# EAGLE design coffee-bot (EAGLE 7.6.0)
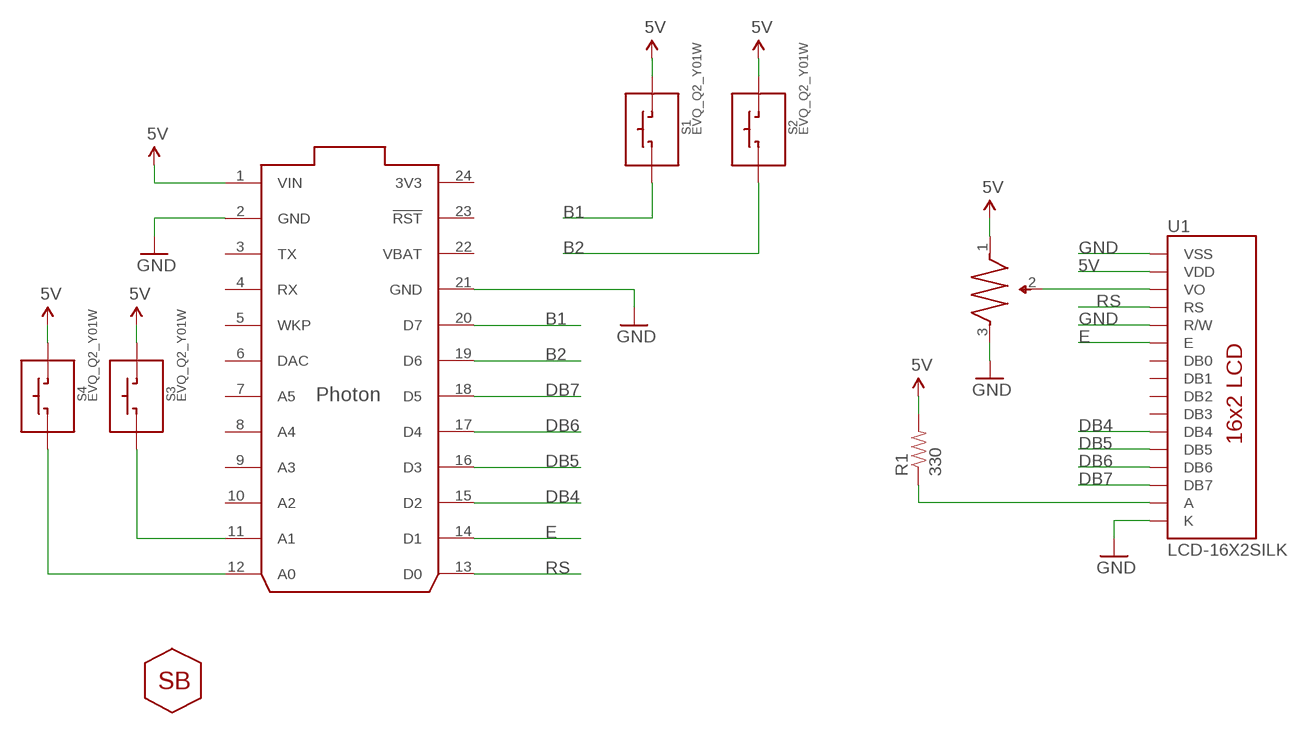
[diagram p0: schematic, sheet 1]

## Parts
R1  330  RESISTOR1206  [1206]
S1  EVQ_Q2_Y01W  [EVQQ2]
S2  EVQ_Q2_Y01W  [EVQQ2]
S3  EVQ_Q2_Y01W  [EVQQ2]
S4  EVQ_Q2_Y01W  [EVQQ2]
U1  LCD-16X2SILK  [LCD-16X2]
U2  PHOTON_SMD  [PHOTON_SMD]
U$2  TC-33X2  [TC-33X2]
U$3  SBLOGO250MIL  [SBLOGO]

## Nets
5V: R1.2 S1.B1(B) S1.B2(B) S2.B1(B) S2.B2(B) S3.B1(B) S3.B2(B) S4.B1(B) S4.B2(B) U1.2(VDD) U2.1(VIN) U$2.1
B1: S1.A1(A) S1.A2(A) U2.20(D7)
B2: S2.A1(A) S2.A2(A) U2.19(D6)
DB4: U1.11(DB4) U2.15(D2)
DB5: U1.12(DB5) U2.16(D3)
DB6: U1.13(DB6) U2.17(D4)
DB7: U1.14(DB7) U2.18(D5)
E: U1.6(E) U2.14(D1)
GND: U1.1(VSS) U1.5(R/W) U1.16(K) U2.2(GND) U2.21(GND) U$2.3
N$1: U1.3(VO) U$2.2
N$3: S4.A1(A) S4.A2(A) U2.12(A0)
N$4: S3.A1(A) S3.A2(A) U2.11(A1)
N$9: R1.1 U1.15(A)
RS: U1.4(RS) U2.13(D0)
Unconnected: U1.7(DB0) U1.8(DB1) U1.9(DB2) U1.10(DB3) U2.3(TX) U2.4(RX) U2.5(WKP) U2.6(DAC) U2.7(A5) U2.8(A4) U2.9(A3) U2.10(A2) U2.23(!RST) U2.25(EN) U2.26(!SETUP) U2.27(RGB_RED) U2.28(RGB_GREEN) U2.29(RGB_BLUE) U2.30(USB_D-) U2.31(USB_D+)

## Power pins joined to a net without a drawn wire
3V3: U2.24(3V3)
VBAT: U2.22(VBAT)

## Library data of the parts
R1 = SparkFun-Passives:RESISTOR: Resistor Basic schematic elements and footprints for 0603, 1206, and PTH resistors.
S1-S4 = carrilib:EVQ_Q2_Y01W: Momentary Pushbutton, SMD Manufacturer: Panasonic Part Number: EVQ-Q2-Y01W (Or Other EVQ-Q2)
U1 = SparkFun-Displays:LCD-16X2: Standard text-only 16x2 parallel input LCD
U2 = Particle:PHOTON_SMD: Photon (without headers) - designed to be surface mounted with 7 extra exposed pads on the bottom of the board which include, 3 RGB LED outputs, /SETUP, EN (3.3V SMPS enable input), USB D+ and USB D-.
U$2 = carrilib:TC-33X2
U$3 = grooop:SBLOGO

## Board
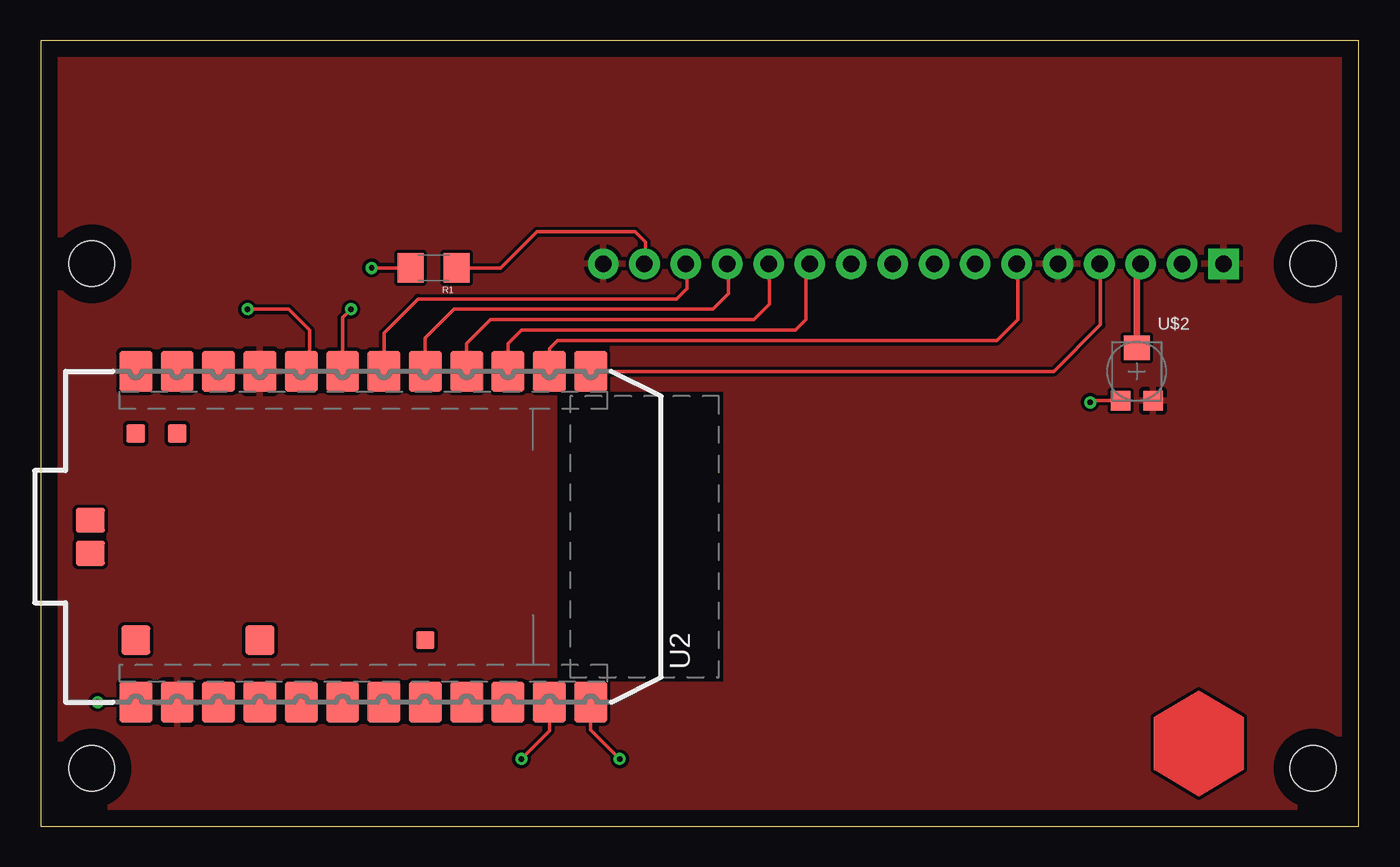
[diagram p1: board, top side]
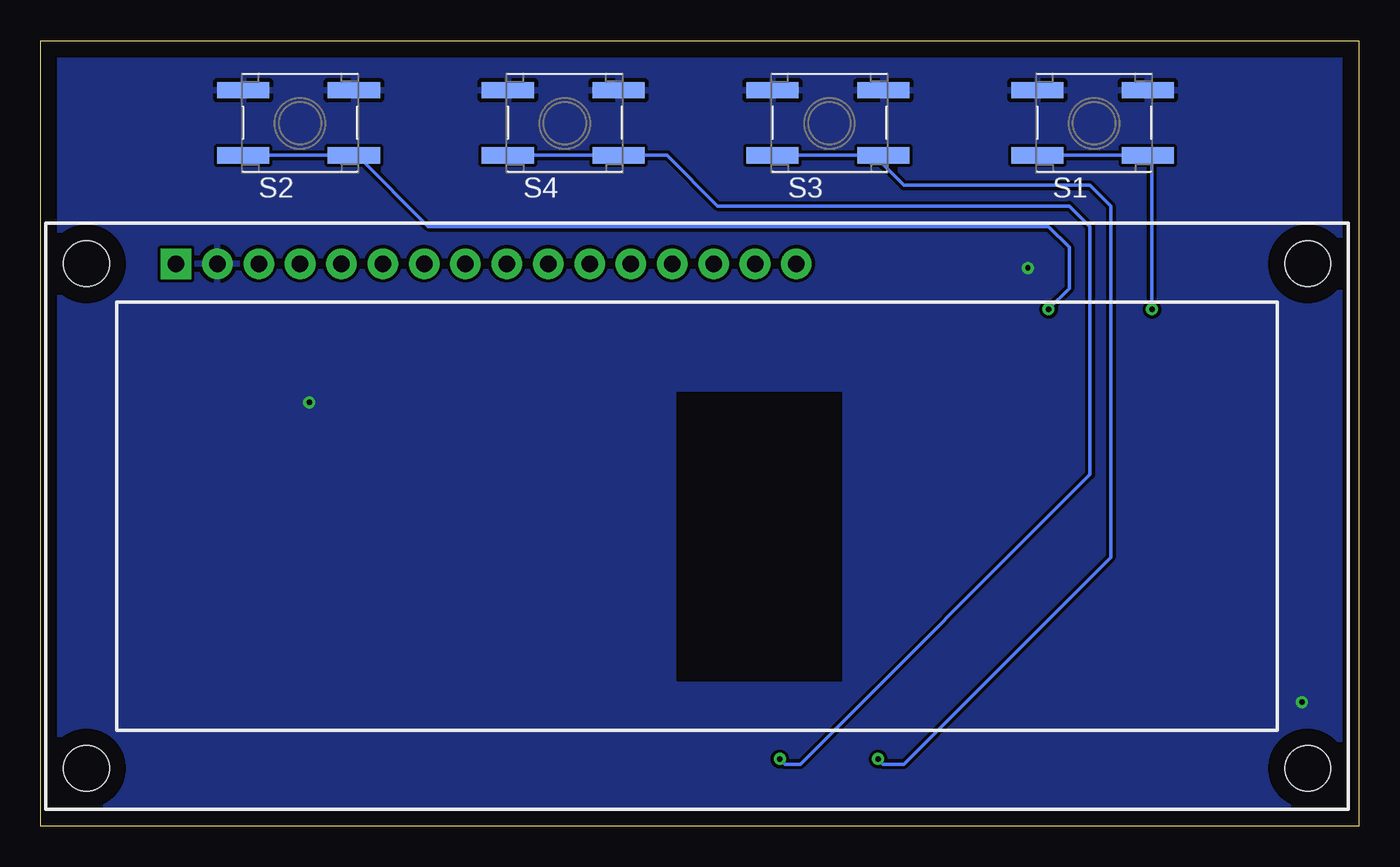
[diagram p2: board, bottom side, seen from below]

Size 80.95 x 48.25 mm. Coordinates in mm from the lower left corner, seen from the top.
Outline: 0,0 80.95,0 80.95,48.25 0,48.25 0,0
Copper layers (1*16): Top 0.035mm / dielectric 1.5mm / Bottom 0.035mm
Design rules "default": minimum track width 10mil, minimum drill 24mil, track to track 8mil, track to pad 8mil, pad to pad 8mil, via to via 8mil, smd to smd 8mil, copper to edge 40mil, drill to drill 8mil, minimum pad ring 10mil, minimum via ring 8mil, stop-mask expansion 4mil, vias tented up to drill 0mil, thermal gap 10mil
tRestrict: area 31.8,8.9 to 41.9,26.7
bRestrict: area 31.8,8.9 to 41.9,26.7

### Footprints (pad centres in the part's own frame; a part is rotated, then mirrored left to right if it is on the bottom)
1206 = smd 1.6 x 1.8: 1 -1.4,0; 2 1.4,0
EVQQ2 = smd 3.2 x 1: A1 -3.493,-1.968; A2 3.308,-1.968; B1 -3.493,2.032; B2 3.308,2.032
LCD-16X2 = drill 1.016 pad 1.88 square: 1 -32,15.5 | drill 1.016 pad 1.88: 2 -29.46,15.5; 3 -26.92,15.5; 4 -24.38,15.5; 5 -21.84,15.5; 6 -19.3,15.5; 7 -16.76,15.5; 8 -14.22,15.5; 9 -11.68,15.5; 10 -9.14,15.5; 11 -6.6,15.5; 12 -4.06,15.5; 13 -1.52,15.5; 14 1.02,15.5; 15 3.56,15.5; 16 6.1,15.5 | hole 2.8: -37.5,15.5; -37.5,-15.5; 37.5,15.5; 37.5,-15.5
PHOTON_SMD = smd 2.54 x 2.032: 1 0,32.258; 2 0,29.718; 3 0,27.178; 4 0,24.638; 5 0,22.098; 6 0,19.558; 7 0,17.018; 8 0,14.478; 9 0,11.938; 10 0,9.398; 11 0,6.858; 12 0,4.318; 13 20.32,4.318; 14 20.32,6.858; 15 20.32,9.398; 16 20.32,11.938; 17 20.32,14.478; 18 20.32,17.018; 19 20.32,19.558; 20 20.32,22.098; 21 20.32,24.638; 22 20.32,27.178; 23 20.32,29.718; 24 20.32,32.258 | smd 1.778 x 1.778: 25 3.81,32.258; 26 3.81,24.638 | smd 1.143 x 1.143: 27 3.81,14.478; 28 16.51,29.718; 29 16.51,32.258 | smd 1.524 x 1.778: 30 11.176,35.052; 31 9.144,35.052
TC-33X2 = smd 1.2 x 1.2: 1 -1,-1.8; 3 1,-1.8 | smd 1.6 x 1.5: 2 0,1.45

### Placement (x,y rotation side)
R1  24.13,34.29 180 top
S1  16.26,43.18 0 bottom
S2  65.02,43.18 0 bottom
S3  32.51,43.18 0 bottom
S4  48.77,43.18 0 bottom
U1  40.64,19.05 0 bottom
U2  38.1,7.62 90 top
U$2  67.31,27.94 0 top
U$3  71.12,5.08 0 top

### Tracks (layer width: path | path; a pad name or v marks a point on that pad's centre or on a via)
5V  (via drill 0.33)
  Top 0.203: U2.1 v3.49,7.62 | R1.2 v20.32,34.29 | U$2.1 64.56,26.14 v64.45,26.04
  pour Bottom: 0,0 81.28,0 81.28,50.8 0,50.8
B1  (via drill 0.33)
  Top 0.203: v12.7,31.75 15.24,31.75 16.51,30.48 16.51,28.45 U2.20
  Bottom 0.203: S1.A1 S1.A2 12.7,40.96 v12.7,31.75
B2  (via drill 0.33)
  Top 0.203: U2.19 18.54,31.24 v19.05,31.75
  Bottom 0.203: S2.A1 S2.A2 61.53,41.21 57.15,36.83 19.05,36.83 17.78,35.56 17.78,33.02 v19.05,31.75
DB4
  Top 0.203: U2.15 28.7,29.65 29.53,30.48 46.35,30.48 46.99,31.11 46.99,34.3 U1.11
DB5
  Top 0.203: U2.16 26.16,29.65 27.62,31.11 43.81,31.11 44.77,32.07 44.77,34.48 U1.12
DB6
  Top 0.203: U2.17 23.62,29.97 25.4,31.75 41.27,31.75 42.23,32.7 42.23,34.48 U1.13
DB7
  Top 0.203: U2.18 21.08,30.29 23.18,32.38 39.05,32.38 39.69,33.02 39.69,34.48 U1.14
E
  Top 0.203: U2.14 31.24,29.34 31.75,29.84 58.74,29.84 60.01,31.11 60.01,34.48 U1.6
GND
  pour Top: 0,48.26 81.28,48.26 81.28,0 0,0
N$1
  Top 0.406: U1.3 67.31,34.55 U$2.2
N$3  (via drill 0.33)
  Top 0.203: U2.12 33.78,5.91 v35.56,4.13
  Bottom 0.203: S4.A1 S4.A2 42.48,41.21 39.37,38.1 17.78,38.1 16.51,36.83 16.51,21.59 34.29,3.81 35.24,3.81 v35.56,4.13
N$4  (via drill 0.33)
  Top 0.203: U2.11 31.24,5.84 v29.53,4.13
  Bottom 0.203: S3.A1 S3.A2 29.2,40.63 27.94,39.37 16.51,39.37 15.24,38.1 15.24,16.51 27.94,3.81 29.21,3.81 v29.53,4.13
N$9
  Top 0.203: R1.1 28.26,34.29 30.48,36.51 36.51,36.51 37.15,35.88 37.15,34.62 U1.15
RS
  Top 0.203: U2.13 62.23,27.94 65.09,30.8 65.09,34.48 U1.4